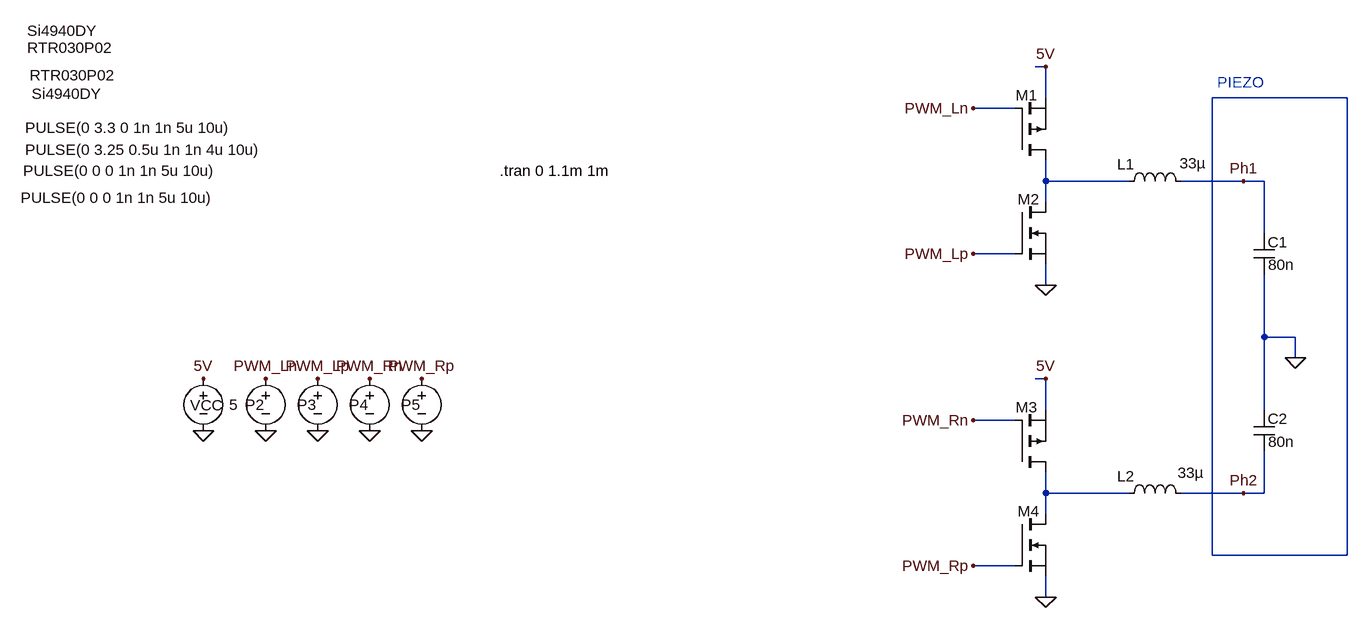
[diagram p0: schematic Piezo Motor Driver.asc]
Piezo Motor Driver.asc, the LTspice schematic file:
Version 4
SHEET 1 880 840
WIRE 176 -112 160 -112
WIRE 176 -64 176 -112
WIRE 640 -64 432 -64
WIRE 128 -48 64 -48
WIRE 176 64 176 32
WIRE 304 64 176 64
WIRE 480 64 384 64
WIRE 512 64 480 64
WIRE 176 96 176 64
WIRE 512 144 512 64
WIRE 128 176 64 176
WIRE 176 224 176 192
WIRE 512 304 512 208
WIRE 560 304 512 304
WIRE 560 336 560 304
WIRE 176 368 160 368
WIRE 176 416 176 368
WIRE 512 416 512 304
WIRE 128 432 64 432
WIRE 176 544 176 512
WIRE 304 544 176 544
WIRE 480 544 384 544
WIRE 512 544 512 480
WIRE 512 544 480 544
WIRE 176 576 176 544
WIRE 432 640 432 -64
WIRE 640 640 640 -64
WIRE 640 640 432 640
WIRE 128 656 64 656
WIRE 176 704 176 672
FLAG 176 -112 5V
FLAG -1120 368 5V
FLAG -1120 448 0
FLAG 176 224 0
FLAG 176 368 5V
FLAG 176 704 0
FLAG 64 -48 PWM_Ln
FLAG 64 176 PWM_Lp
FLAG 64 432 PWM_Rn
FLAG 64 656 PWM_Rp
FLAG 560 336 0
FLAG -1024 368 PWM_Ln
FLAG -1024 448 0
FLAG -944 368 PWM_Lp
FLAG -944 448 0
FLAG -864 368 PWM_Rn
FLAG -864 448 0
FLAG -784 368 PWM_Rp
FLAG -784 448 0
FLAG 480 64 Ph1
FLAG 480 544 Ph2
SYMBOL voltage -1120 352 R0
WINDOW 0 -20 57 Left 2
WINDOW 3 40 56 Left 2
WINDOW 123 0 0 Left 0
WINDOW 39 0 0 Left 0
SYMATTR InstName VCC
SYMATTR Value 5
SYMBOL nmos 128 96 R0
WINDOW 3 -1519 -263 Left 2
WINDOW 0 2 -164 Left 2
SYMATTR Value Si4940DY
SYMATTR InstName M1
SYMBOL pmos 128 32 M180
WINDOW 3 -1519 173 Left 2
WINDOW 0 5 -60 Left 2
SYMATTR Value RTR030P02
SYMATTR InstName M2
SYMBOL ind 288 80 R270
WINDOW 0 26 11 VTop 2
WINDOW 3 59 114 VBottom 2
SYMATTR InstName L1
SYMATTR Value 33µ
SYMATTR SpiceLine Ipk=20 Rser=0
SYMBOL cap 496 144 R0
WINDOW 0 21 14 Left 2
WINDOW 3 22 49 Left 2
SYMATTR InstName C1
SYMATTR Value 80n
SYMATTR SpiceLine Rser=2 Cpar=0
SYMBOL nmos 128 576 R0
WINDOW 3 -1512 -646 Left 2
WINDOW 0 2 -164 Left 2
SYMATTR Value Si4940DY
SYMATTR InstName M3
SYMBOL pmos 128 512 M180
WINDOW 3 -1515 611 Left 2
WINDOW 0 5 -60 Left 2
SYMATTR Value RTR030P02
SYMATTR InstName M4
SYMBOL ind 288 560 R270
WINDOW 0 26 11 VTop 2
WINDOW 3 63 111 VBottom 2
SYMATTR InstName L2
SYMATTR Value 33µ
SYMATTR SpiceLine Ipk=20 Rser=0
SYMBOL cap 496 416 R0
WINDOW 0 21 14 Left 2
WINDOW 3 22 49 Left 2
SYMATTR InstName C2
SYMATTR Value 80n
SYMBOL voltage -1024 352 R0
WINDOW 123 0 0 Left 0
WINDOW 39 0 0 Left 0
WINDOW 0 -32 56 Left 2
WINDOW 3 -370 -370 Left 2
SYMATTR InstName P2
SYMATTR Value PULSE(0 3.3 0 1n 1n 5u 10u)
SYMBOL voltage -944 352 R0
WINDOW 123 0 0 Left 0
WINDOW 39 0 0 Left 0
WINDOW 0 -32 56 Left 2
WINDOW 3 -450 -336 Left 2
SYMATTR InstName P3
SYMATTR Value PULSE(0 3.25 0.5u 1n 1n 4u 10u)
SYMBOL voltage -864 352 R0
WINDOW 123 0 0 Left 0
WINDOW 39 0 0 Left 0
WINDOW 0 -32 56 Left 2
WINDOW 3 -533 -304 Left 2
SYMATTR InstName P4
SYMATTR Value PULSE(0 0 0 1n 1n 5u 10u)
SYMBOL voltage -784 352 R0
WINDOW 123 0 0 Left 0
WINDOW 39 0 0 Left 0
WINDOW 0 -32 56 Left 2
WINDOW 3 -617 -262 Left 2
SYMATTR InstName P5
SYMATTR Value PULSE(0 0 0 1n 1n 5u 10u)
TEXT -664 48 Left 2 !.tran 0 1.1m 1m
TEXT 440 -88 Left 2 ;PIEZO

The netlist it stands for:
* Piezo Motor Driver.asc
VCC 5V 0 5
M1 N002 PWM_Lp 0 0 Si4940DY
M2 N002 PWM_Ln 5V 5V RTR030P02
L1 N002 Ph1 33µ Ipk=20 Rser=0
C1 Ph1 0 80n Rser=2 Cpar=0
M3 N003 PWM_Rp 0 0 Si4940DY
M4 N003 PWM_Rn 5V 5V RTR030P02
L2 N003 Ph2 33µ Ipk=20 Rser=0
C2 0 Ph2 80n
V§P2 PWM_Ln 0 PULSE(0 3.3 0 1n 1n 5u 10u)
V§P3 PWM_Lp 0 PULSE(0 3.25 0.5u 1n 1n 4u 10u)
V§P4 PWM_Rn 0 PULSE(0 0 0 1n 1n 5u 10u)
V§P5 PWM_Rp 0 PULSE(0 0 0 1n 1n 5u 10u)
.model NMOS NMOS
.model PMOS PMOS
.lib standard.mos
.tran 0 1.1m 1m
* PIEZO
.backanno
.end